# Altium schematic sheet EXP02_04_2307_20232241110.SchDoc: 稳压二极管伏安特性测试
size A4 portrait; PageSetup: Record=PageOptions|CenterHorizontal=True|CenterVertical=True|PrintScale=1.00|XCorrection=1.00|YCorrection=1.00|PrintKind=0|BorderSize=5000000|LeftOffset=0|BottomOffset=0|Orientation=1|PaperLength=1000|PaperWidth=1000|Scale=100|PaperSource=7|PrintQuality=-4|MediaType=1|DitherType=10|PaperKind=A4|PrintScaleMode=1
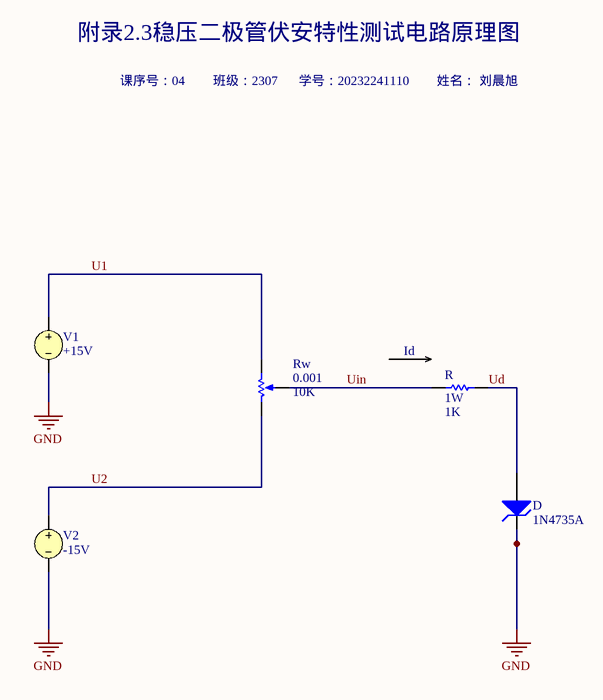
[diagram p0: EXP02_04_2307_20232241110.SchDoc]

## Parts
D  1N4735A  [DO-41]
R  1W  value 1K  [AXIAL-0.3]
Rw  value 10K  Set Position: 0.001  [VR5]  (hidden comment: RPot)
V1  value +15V  (hidden comment: VSRC)
V2  value -15V  (hidden comment: VSRC)

## Nets
GND: D.2(K) V1.2 V2.2
U1: Rw.1(TOP) V1.1
U2: Rw.2(BOT) V2.1
Ud: D.1(A) R.2
Uin: R.1 Rw.3(TAP)

## Notes on the sheet
- 附录2.3稳压二极管伏安特性测试电路原理图
- 课序号：04        班级：2307      学号：20232241110        姓名： 刘晨旭
- (near R) Id

## Library data of the parts
D = 1N4735A: One Watt Zener; Published: 8-Jun-2000; LatestRevisionDate: 17-Jul-2002; LatestRevisionNote: Re-released for DXP Platform.; DatasheetDocument: 1997; PackageDocument: Aug-1999; PackageReference: DO-41; Publisher: Altium Limited; Code_JEDEC: DO-204-AL; ComponentLink1Description: Manufacturer Link; ComponentLink1URL: http://www.fairchildsemi.com/; ComponentLink2Description: Datasheet; ComponentLink2URL: http://www.fairchildsemi.com/ds/1N%2F1N4728A.pdf
R = Res1: Resistor; Published: 8-Jun-2000; LatestRevisionDate: 17-Jul-2002; LatestRevisionNote: Re-released for DXP Platform.; PackageReference: AXIAL-0.3; Publisher: Altium Limited
Rw = RPot: Potentiometer; Sim Note: Enter the Resistance value and the set point into parameter fields.; Published: 8-Jun-2000; LatestRevisionDate: 17-Jul-2002; LatestRevisionNote: Re-released for DXP Platform.; PackageReference: VR5; Publisher: Altium Limited
V1 V2 = VSRC: Voltage Source; Note: PCB Footprint - Not required; Published: 8-Jun-2000; LatestRevisionDate: 17-Jul-2002; LatestRevisionNote: Re-released for DXP Platform.; PackageReference: Not Applicable; Publisher: Altium Limited